# Altium project PCB_Only_pH.PrjPcb
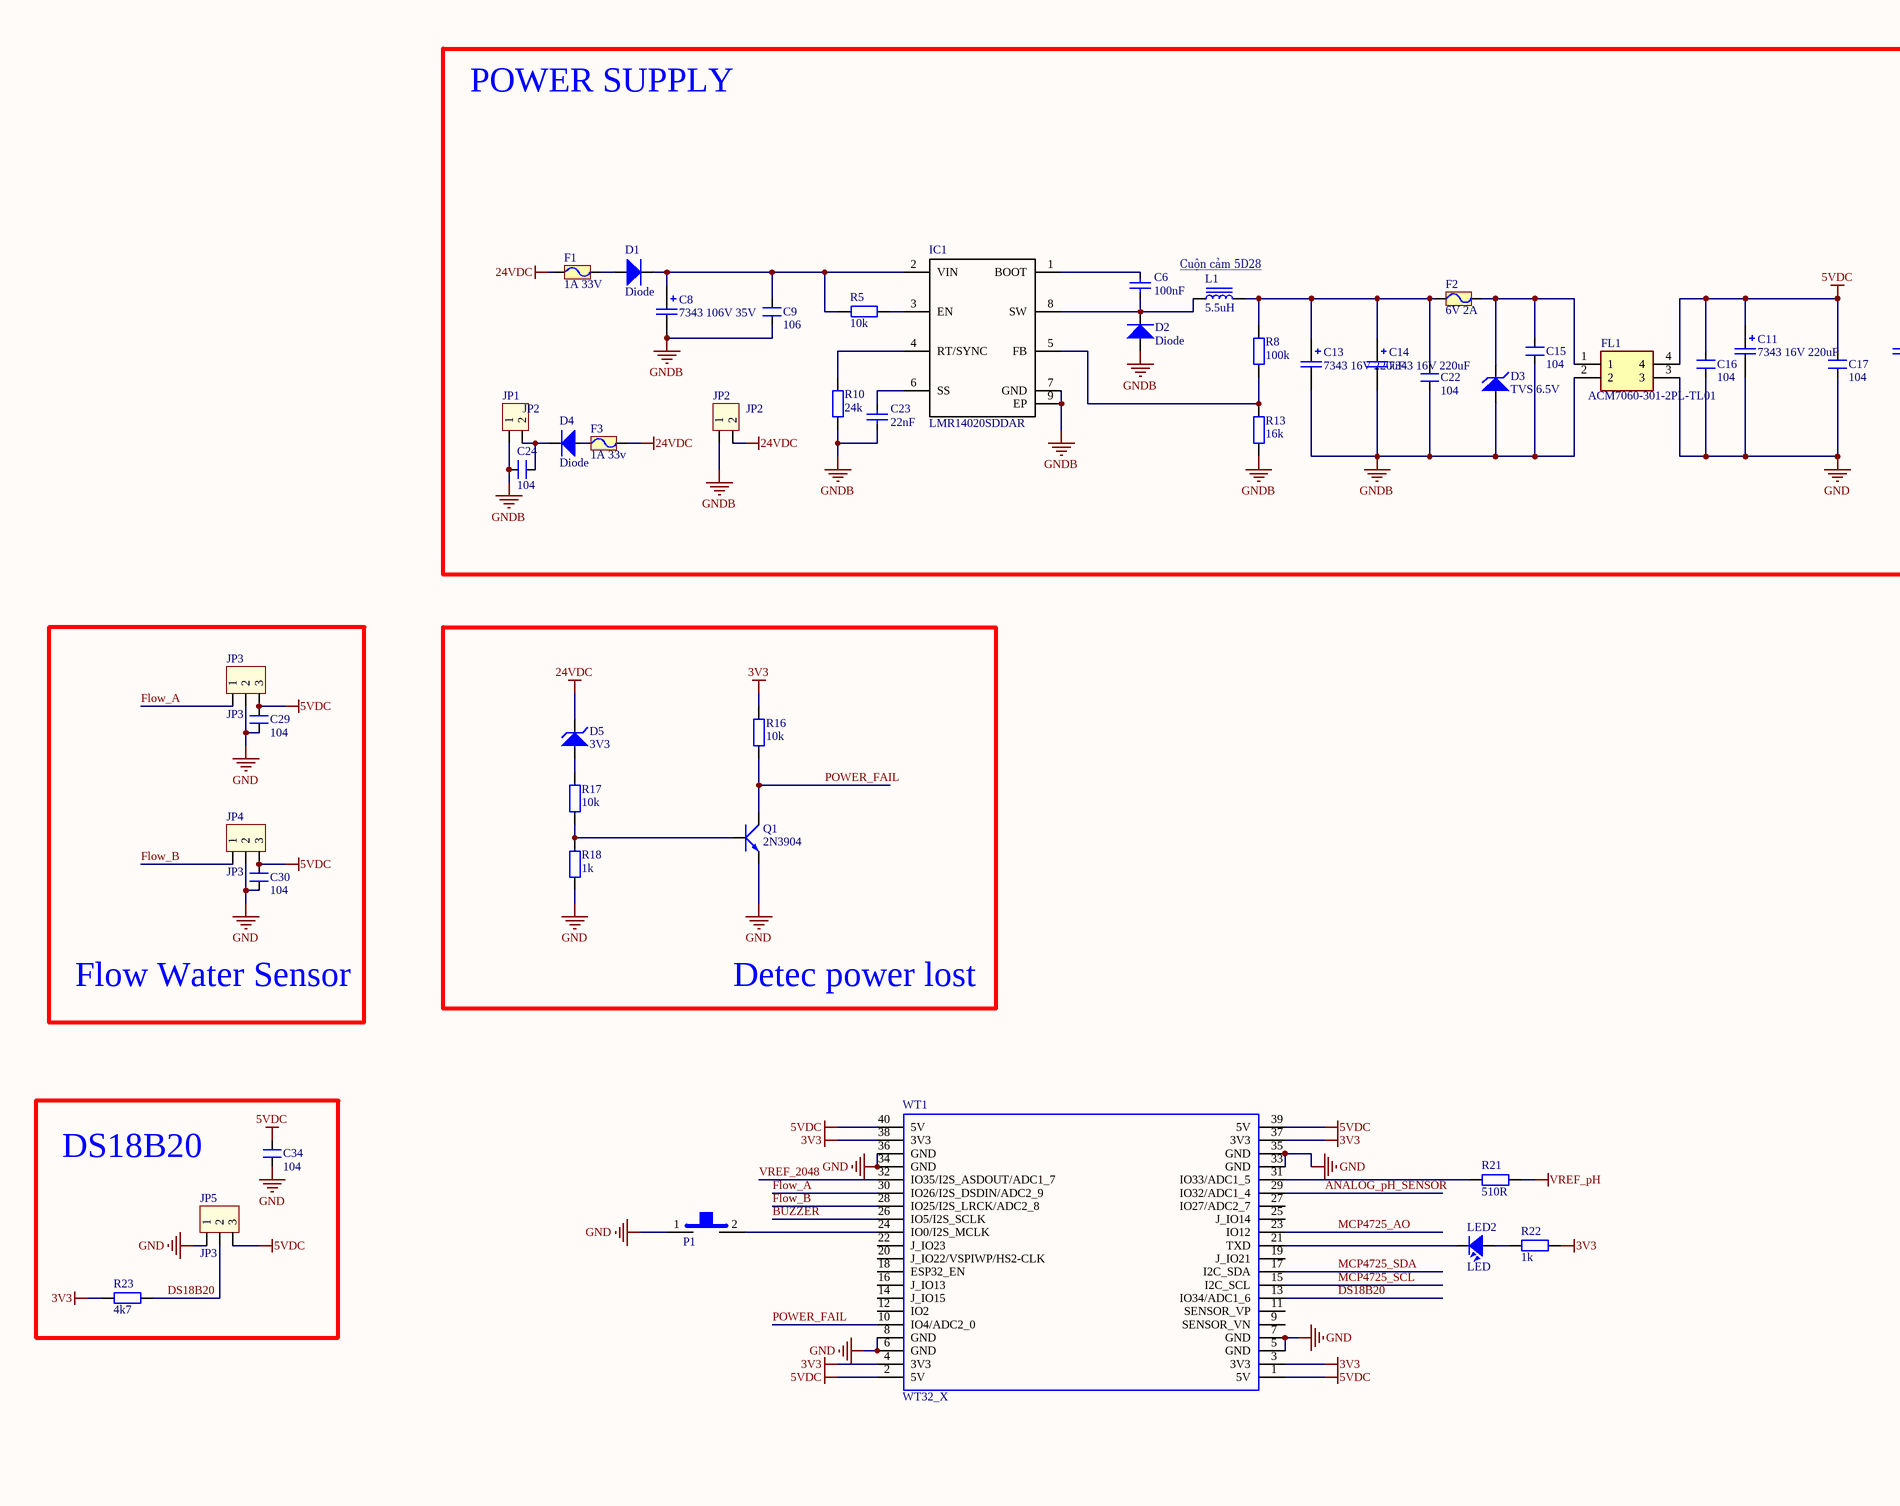
[diagram p0: Only_pH.SchDoc, left]
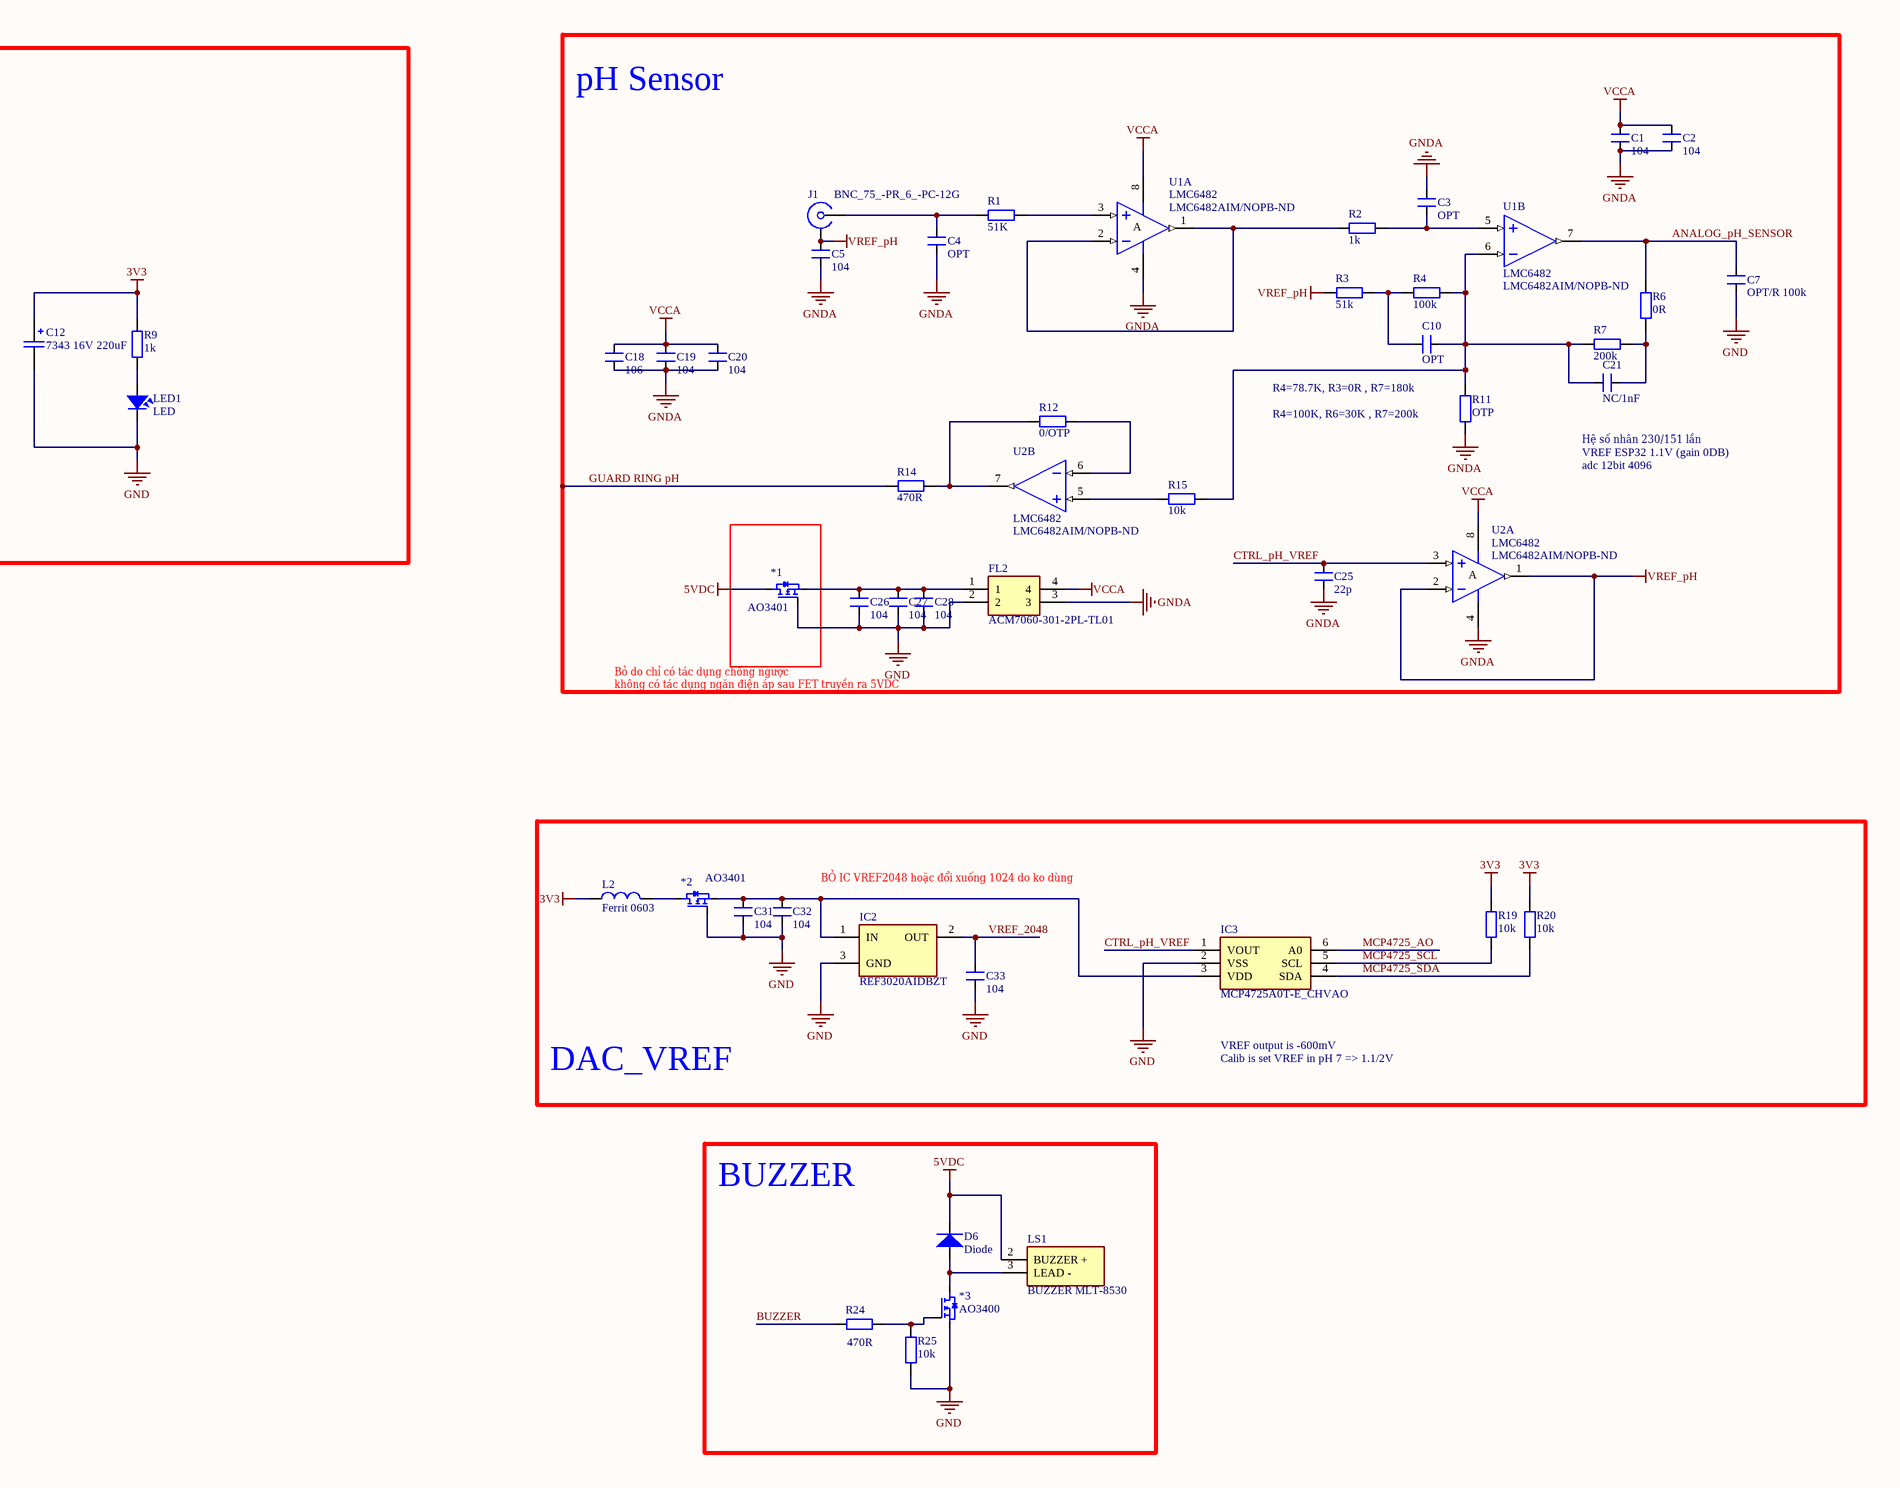
[diagram p1: Only_pH.SchDoc, right]
1 sheet, 92 parts. Net scope: global (net labels, ports and power ports of the same name join across sheets).
Board file: Only_pH.PcbDoc

## Sheet Only_pH.SchDoc
size A0

### Parts
*1  AO3401  [SOT23-123]
*2  AO3401  [SOT23-123]
*3  AO3400  [SOT23-123]
C1  104  [SM-0805]
C2  104  [SM-0805]
C3  OPT  [CAPC-0603 (1608)]
C4  OPT  [CAPC-0603 (1608)]
C5  104  [SM-0805]
C6  100nF  [SM-0603]
C7  OPT/R 100k  [CAPC-0603 (1608)]
C8  7343 106V 35V  [CAP_TANTAL_2917(7343-31)]
C9  106  [SM-0805]
C10  OPT  [CAPC-0603 (1608)]
C11  7343 16V 220uF  [CAP_TANTAL_2917(7343-31)]
C12  7343 16V 220uF  [CAP_TANTAL_2917(7343-31)]
C13  7343 16V 220uF  [CAP_TANTAL_2917(7343-31)]
C14  7343 16V 220uF  [CAP_TANTAL_2917(7343-31)]
C15  104  [SM-0805]
C16  104  [SM-0805]
C17  104  [SM-0805]
C18  106  [SM-0805]
C19  104  [SM-0805]
C20  104  [SM-0805]
C21  NC/1nF  [CAPC-0603 (1608)]
C22  104  [SM-0805]
C23  22nF  [SM-0603]
C24  104  [SM-0805]
C25  22p  [SM-0805]
C26  104  [SM-0805]
C27  104  [SM-0805]
C28  104  [SM-0805]
C29  104  [SM-0805]
C30  104  [SM-0805]
C31  104  [SM-0805]
C32  104  [SM-0805]
C33  104  [SM-0603]
C34  104  [SM-0805]
D1  Diode  [DIO-SMD-106]
D2  Diode  [DIO-SMD-106]
D3  TVS 6.5V  [DIO-SMD-106]
D4  Diode  [DIO-SMD-106]
D5  3V3  [DIO-SMD-106]
D6  Diode  [DIO-SMD-123]
F1  1A 33V  [RES-SMD-1812]
F2  6V 2A  [RES-SMD-1812]
F3  1A 33v  [RES-SMD-1812]
FL1  ACM7060-301-2PL-TL01  [ACM70603012PLTL01]
FL2  ACM7060-301-2PL-TL01  [ACM70603012PLTL01]
IC1  LMR14020SDDAR  [SOIC127P600X170-9N]
IC2  REF3020AIDBZT  [SOT95P237X112-3N]
IC3  MCP4725A0T-E_CHVAO  [SOT95P270X145-6N]
J1  BNC_75_-PR_6_-PC-12G  [BNC75PR6PC12G]
JP1  JP2  [CON2]
JP2  JP2  [CON2]
JP3  JP3  [CON3]
JP4  JP3  [CON3]
JP5  JP3  [CON3]
L1  5.5uH  [WURTH WE-HCI 7040]
L2  Ferrit 0603  [IND-0603 (1608)]
LED1  LED  [SM-LED-0805-Blue]
LED2  LED  [SM-LED-0805-Blue]
LS1  BUZZER MLT-8530  [MLT8530]
P1  (no value)  [SW 2P SMD]
Q1  2N3904  [SOT23-231]
R1  51K  [RES-SMD-0603]
R2  1k  [RES-SMD-0603]
R3  51k  [RES-SMD-0603]
R4  100k  [RES-SMD-0603]
R5  10k  [RES-SMD-0603]
R6  0R  [RES-SMD-0603]
R7  200k  [RES-SMD-0603]
R8  100k  [RES-SMD-0603]
R9  1k  [RES-SMD-0603]
R10  24k  [RES-SMD-0603]
R11  OTP  [RES-SMD-0603]
R12  0/OTP  [RES-SMD-0603]
R13  16k  [RES-SMD-0603]
R14  470R  [RES-SMD-0603]
R15  10k  [RES-SMD-0603]
R16  10k  [RES-SMD-0603]
R17  10k  [RES-SMD-0603]
R18  1k  [RES-SMD-0603]
R19  10k  [RES-SMD-0603]
R20  10k  [RES-SMD-0603]
R21  510R  [RES-SMD-0603]
R22  1k  [RES-SMD-0603]
R23  4k7  [RES-SMD-0603]
R24  470R  [RES-SMD-0603]
R25  10k  [RES-SMD-0603]
U1  LMC6482  Supplier Part Number 1: LMC6482AIM/NOPB-ND  [SOIC-8]  (parts A,B of 2)
U2  LMC6482  Supplier Part Number 1: LMC6482AIM/NOPB-ND  [SOIC-8]  (parts A,B of 2)
WT1  WT32_X  [WT32_SC01_Sheild]

### Nets
3V3: C12.1 L2.1 R9.2 R16.1 R19.1 R20.1 R22.2 R23.1 WT1.3(3V3) WT1.4(3V3) WT1.37(3V3) WT1.38(3V3)
5VDC: *1.2 C11.1 C16.2 C17.2 C29.2 C30.2 C34.2 D6.2 FL1.4 JP3.3 JP4.3 JP5.3 LS1.2(BUZZER_+) WT1.1(5V) WT1.2(5V) WT1.39(5V) WT1.40(5V)
24VDC: D5.2 F1.2 F3.1 JP2.2
GND: *1.1 *2.1 *3.3 C7.2 C11.2 C12.2 C16.1 C17.1 C26.2 C27.2 C28.2 C29.1 C30.1 C31.2 C32.2 C33.1 C34.1 FL1.3 FL2.2 IC2.3(GND) IC3.2(VSS) JP3.2 JP4.2 JP5.1 LED1.2 P1.1 Q1.1(E) R18.2 R25.1 WT1.5(GND) WT1.6(GND) WT1.7(GND) WT1.8(GND) WT1.33(GND) WT1.34(GND) WT1.35(GND) WT1.36(GND)
GNDA: C1.2 C2.2 C3.1 C4.2 C5.1 C18.2 C19.2 C20.2 C25.2 FL2.3 R11.2 U1.4(V-) U2.4(V-)
GNDB: C8.2 C9.1 C13.2 C14.2 C15.1 C22.1 C23.1 C24.2 D2.1 D3.1 FL1.2 IC1.7(GND) IC1.9(EP) JP1.1 JP2.1 R10.1 R13.2
VCCA: C1.1 C2.1 C18.1 C19.1 C20.1 FL2.4 U1.8(V+) U2.8(V+)
VREF_pH: C5.2 J1.2 J1.3 J1.4 J1.5 R3.2 R21.2 U2.1(OUT) U2.2(IN-)
ANALOG_pH_SENSOR: C7.1 R6.1 U1.7(OUT) WT1.29(IO32/ADC1_4)
BUZZER: R24.2 WT1.26(IO5/I2S_SCLK)
CTRL_pH_VREF: C25.1 IC3.1(VOUT) U2.3(IN+)
DS18B20: JP5.2 R23.2 WT1.13(IO34/ADC1_6)
Flow_A: JP3.1 WT1.30(IO26/I2S_DSDIN/ADC2_9)
Flow_B: JP4.1 WT1.28(IO25/I2S_LRCK/ADC2_8)
GUARD RING pH: R14.2
MCP4725_AO: IC3.6(A0) WT1.23(IO12)
MCP4725_SCL: IC3.5(SCL) R19.2 WT1.15(I2C_SCL)
MCP4725_SDA: IC3.4(SDA) R20.2 WT1.17(I2C_SDA)
POWER_FAIL: Q1.3(C) R16.2 WT1.10(IO4/ADC2_0)
VREF_2048: C33.2 IC2.2(OUT) WT1.32(IO35/I2S_ASDOUT/ADC1_7)
Net*1_3: *1.3 C26.1 C27.1 C28.1 FL2.1
Net*2_2: *2.2 L2.2
Net*2_3: *2.3 C31.1 C32.1 IC2.1(IN) IC3.3(VDD)
Net*3_1: *3.1 R24.1 R25.2
Net*3_2: *3.2 D6.1 LS1.3(LEAD_-)
NetC3_2: C3.2 R2.1 U1.5(IN+)
NetC4_1: C4.1 J1.1 R1.2
NetC6_1: C6.1 D2.2 IC1.8(SW) L1.1
NetC6_2: C6.2 IC1.1(BOOT)
NetC8_1: C8.1 C9.2 D1.2 IC1.2(VIN) R5.1
NetC10_1: C10.1 R3.1 R4.2
NetC10_2: C10.2 C21.1 R4.1 R7.2 R11.1 R15.1 U1.6(IN-)
NetC13_1: C13.1 C14.1 C22.2 F2.2 L1.2 R8.1
NetC15_2: C15.2 D3.2 F2.1 FL1.1
NetC21_2: C21.2 R6.2 R7.1
NetC23_2: C23.2 IC1.6(SS)
NetC24_1: C24.1 D4.2 JP1.2
NetD1_1: D1.1 F1.1
NetD4_1: D4.1 F3.2
NetD5_1: D5.1 R17.2
NetIC1_3: IC1.3(EN) R5.2
NetIC1_4: IC1.4(RT/SYNC) R10.2
NetIC1_5: IC1.5(FB) R8.2 R13.1
NetLED1_1: LED1.1 R9.1
NetLED2_1: LED2.1 R22.1
NetLED2_2: LED2.2 WT1.21(TXD)
NetP1_2: P1.2 WT1.24(IO0/I2S_MCLK)
NetQ1_2: Q1.2(B) R17.1 R18.1
NetR1_1: R1.1 U1.3(IN+)
NetR2_2: R2.2 U1.1(OUT) U1.2(IN-)
NetR12_1: R12.1 R14.1 U2.7(OUT)
NetR12_2: R12.2 U2.6(IN-)
NetR15_2: R15.2 U2.5(IN+)
NetR21_1: R21.1 WT1.31(IO33/ADC1_5)

Not connected (* = marked no-connect by the designer): WT1 9(SENSOR_VN) 11(SENSOR_VP) 12(IO2) 14(J_IO15) 16(J_IO13) 18(ESP32_EN) 19(J_IO21) 20(J_IO22/VSPIWP/HS2-CLK) 22(J_IO23) 25(J_IO14) 27(IO27/ADC2_7)

### Notes on the sheet
- Cuộn cảm 5D28 <http://www.linhkienchatluong.vn/cuon-cam-dan-cd-cac-loai/cuon-cam-5d28-15a-tu-22uh-den-470uh-6x6x28mm_sp1061_ct7500.aspx>
- R4=78.7K, R3=0R , R7=180k
- R4=100K, R6=30K , R7=200k
- Hệ số nhân 230/151 lần
- VREF ESP32 1.1V (gain 0DB)
- adc 12bit 4096
- Bỏ do chỉ có tác dụng chống ngược
- không có tác dụng ngăn điện áp sau FET truyền ra 5VDC
- BỎ IC VREF2048 hoặc đổi xuống 1024 do ko dùng
- VREF output is -600mV
- Calib is set VREF in pH 7 => 1.1/2V
- Labels drawn without touching a wire or pin: BUZZER, DAC_VREF, Detec power lost, DS18B20, Flow Water Sensor, pH Sensor, POWER SUPPLY
- (in symbol LMC6482, part A) A

### Library data of the parts
C1-C5 C7 C9 C10 C15-C22 C24-C34 = CM: Cap SMD; Value: 103
C6 C23 = CAP_NP: Value: 0.1
C8 = TAJD107K016RNJ: http://www.linhkienchatluong.vn/tu-tantalium/tu-tantalum-7343-106v-35v-10uf-73x43mm_sp460_ct4760.aspx; Solder: SMT; CompanyID: VT-00022; Value: 107/16V; MPN: TAJD107K016RNJ; Category: CAPACITOR; PinCount: 2
C11-C14 = TAJD107K016RNJ: http://linhkienviet.vn/tu-tantalum-16v-220uf-7343; Solder: SMT; CompanyID: VT-00022; Value: 107/16V; MPN: TAJD107K016RNJ; Category: CAPACITOR; PinCount: 2
D3 D5 = Diode Zener: Part Number: BZV55-C5V1; Pricing: *
F1-F3 = FUSE_1
FL1 FL2 = ACM7060-301-2PL-TL01: Filter; Manufacturer_Name: TDK; Datasheet Link: https://componentsearchengine.com/Datasheets/1/ACM7060-301-2PL-TL01.pdf; Height: 3.5mm; Manufacturer_Part_Number: ACM7060-301-2PL-TL01; Mouser Part Number: 810-ACM7063012PLTL01; Mouser Price/Stock: https://www.mouser.co.uk/ProductDetail/TDK/ACM7060-301-2PL-TL01?qs=XtcaLsi12kuLPtyDTh4ZWA%3D%3D; Arrow Part Number: ACM7060-301-2PL-TL01; Arrow Price/Stock: https://www.arrow.com/en/products/acm7060-301-2pl-tl01/tdk?region=nac
IC1 = LMR14020SDDAR: Integrated Circuit; Manufacturer_Name: Texas Instruments; Datasheet Link: http://www.ti.com/lit/gpn/lmr14020; Height: 1.7mm; Manufacturer_Part_Number: LMR14020SDDAR; Mouser Part Number: 595-LMR14020SDDAR; Mouser Price/Stock: https://www.mouser.co.uk/ProductDetail/Texas-Instruments/LMR14020SDDAR?qs=Q2snjRlG%2FBLpJ6bVOizpDA%3D%3D; Arrow Part Number: LMR14020SDDAR; Arrow Price/Stock: https://www.arrow.com/en/products/lmr14020sddar/texas-instruments
IC2 = REF3020AIDBZT: Integrated Circuit; Manufacturer_Name: Texas Instruments; Datasheet Link: http://www.ti.com/lit/ds/symlink/ref3020.pdf; Height: 1.12mm; Manufacturer_Part_Number: REF3020AIDBZT; Mouser Part Number: 595-REF3020AIDBZT; Mouser Price/Stock: https://www.mouser.co.uk/ProductDetail/Texas-Instruments/REF3020AIDBZT?qs=sSOk4GDDv7z1DbPVs3eJeA%3D%3D; Arrow Part Number: REF3020AIDBZT; Arrow Price/Stock: https://www.arrow.com/en/products/ref3020aidbzt/texas-instruments
IC3 = MCP4725A0T-E_CHVAO: Integrated Circuit; Manufacturer_Name: Microchip; Manufacturer_Part_Number: MCP4725A0T-E/CHVAO; Datasheet Link: http://ww1.microchip.com/downloads/en/devicedoc/22039d.pdf; Height: 1.45mm; Mouser Part Number: 579-MCP4725A0TECHVAO; Mouser Price/Stock: https://www.mouser.co.uk/ProductDetail/Microchip-Technology/MCP4725A0T-E-CHVAO?qs=5aG0NVq1C4ze67bMeWos3Q%3D%3D; Arrow Part Number: MCP4725A0T-E/CHVAO; Arrow Price/Stock: https://www.arrow.com/en/products/mcp4725a0t-echvao/microchip-technology
J1 = BNC_75_-PR_6_-PC-12G: Connector; Manufacturer_Name: Hirose; Manufacturer_Part_Number: BNC(75)-PR(6)-PC-12G; Datasheet Link: https://www.hirose.com/product/en/download_file/key_name/BNC%2875%29-PR%286%29-PC-12G/category/Drawing%20(2D)/doc_file_id/165956/?file_category_id=6&item_id=03020086000&is_series=; Height: 21.1mm; Mouser Part Number: 798-BNC75-PR6-PC-12G; Mouser Price/Stock: https://www.mouser.co.uk/ProductDetail/Hirose-Connector/BNC75-PR6-PC-12G?qs=vdi0iO8H4N1chcA2yXdD4w%3D%3D
JP1 JP2 = Con2: Connector 2; Value: Connector 2
JP3-JP5 = Con3: Connector 3; Value: Connector 3
L1 = Inductor_3: SMT Inductor; Value: 1.5uH
L2 = LB1608T100M: FIXED IND 10UH 60MA 700 MOHM SMD; CompanyID: VT-01060; Solder: SMT; MPN: LB1608T100M; Value: 10uH; Category: FERRITE BEAD; PinCount: 2
LS1 = BUZZER MLT-8530: Loudspeaker or Buzzer; Manufacturer_Name: Jiangsu Huaneng Elec; Datasheet Link: https://datasheet.lcsc.com/szlcsc/1811182003_Jiangsu-Huaneng-Elec-MLT-8530_C94599.pdf; Height: 3mm; Manufacturer_Part_Number: MLT-8530
P1 = Button 2 SMD: SMD Mini Push Button Switch 2 Pin 3x6x2.7mm; MPN: SMD Mini Push Button 2 SMD; Link: https://ram-e-shop.com/product/press2pin-smd/
Q1 = 2N3904: NPN 600mW, ECB; Value: C1815
R1-R25 = R: Resistor R1/4W
U1 U2 = LMC6482: LMC6482 CMOS Dual Rail-to-Rail Input and Output Operational Amplifier; MFR: Ti; Solder: SMT; MPN: LMC6482; Value: LMC6482; Category: IC; PinCount: 8; Supplier 1: Digi-Key
WT1 = WT32-SC01